# Altium schematic sheet si4463.SchDoc
size A; SheetNumber: 4; SheetTotal: 7
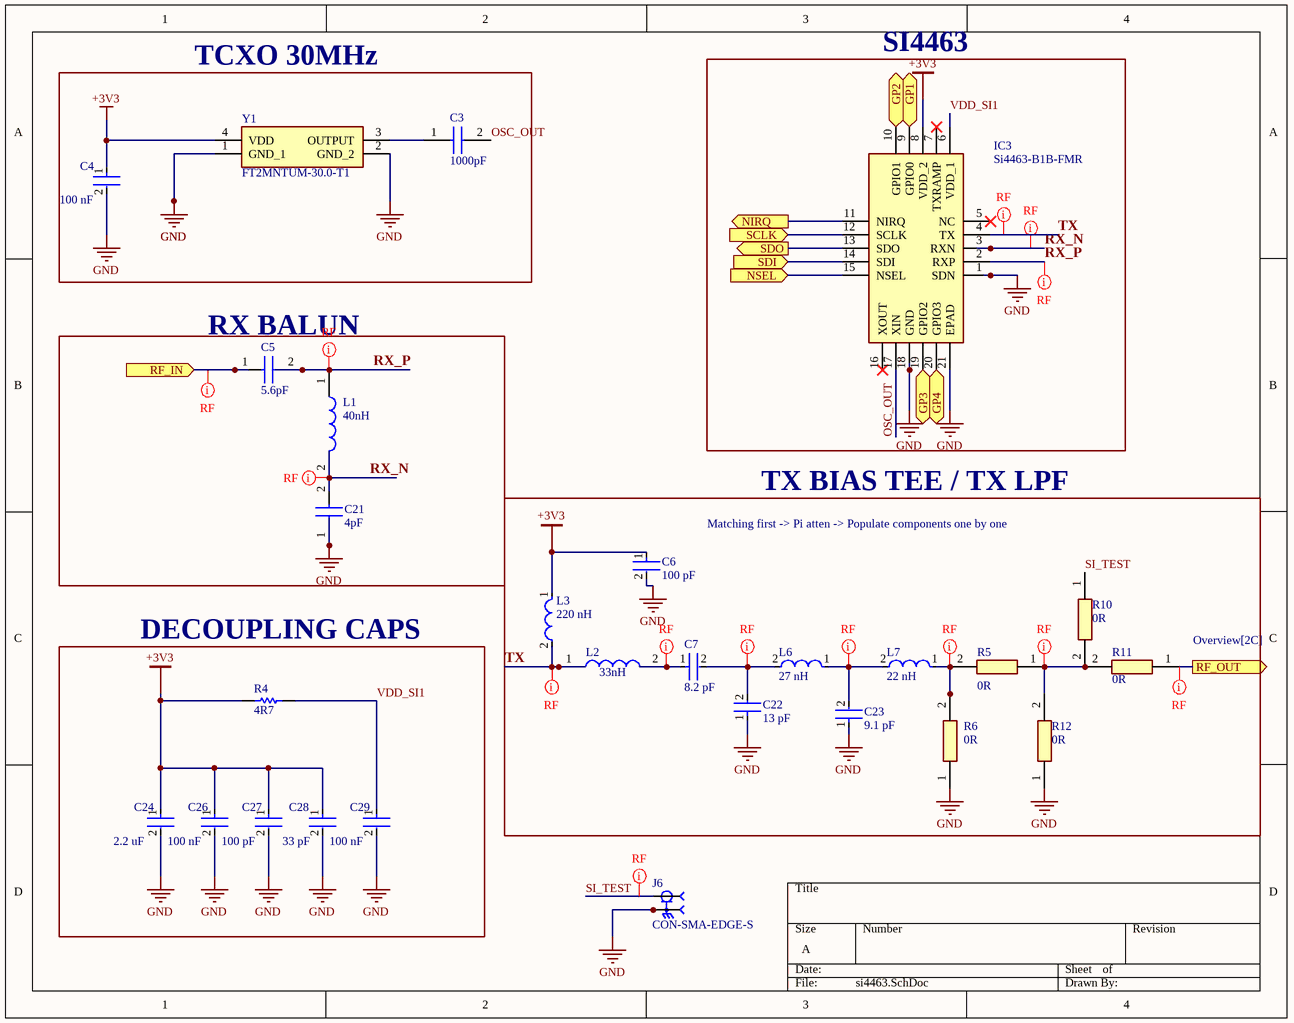
[diagram p0: si4463.SchDoc]

## Parts
C3  1000pF  [C0402]
C4  100 nF  [FP-GCM155-0_05-IPC_C]
C5  5.6pF  [CAPC1005X55N]
C6  100 pF  [FP-GQM187-0_15-MFG]
C7  8.2 pF  [FP-GJM155-0_05-MFG]
C21  4pF  [CAPC1005X55N]
C22  13 pF  [FP-GJM155-0_05-IPC_B]
C23  9.1 pF  [FP-GJM155-0_05-IPC_B]
C24  2.2 uF  [FP-GRM155-0_2-IPC_A]
C26  100 nF  [FP-GCM155-0_05-IPC_C]
C27  100 pF  [FP-GQM187-0_15-MFG]
C28  33 pF  [FP-GJM155-0_05-MFG]
C29  100 nF  [FP-GCM155-0_05-IPC_C]
IC3  Si4463-B1B-FMR  [QFN50P400X400X90-21N-D]
J6  CON-SMA-EDGE-S  [RFSOLUTIONS_CON-SMA-EDGE-S]
L1  40nH  [LQW15CNR20J00B]
L2  33nH  [LQW15CNR20J00B]
L3  220 nH  [FP-LQW18AN_80-MFG]
L6  27 nH  [FP-LQW15AN_00-W0_5-0_1-MFG]
L7  22 nH  [FP-LQW15AN_00-W0_6-0_1-MFG]
R4  4R7  [RESC3216X65X100LL20T15]
R5  0R  [RESC1608X55N]
R6  0R  [RESC1608X55N]
R10  0R  [RESC1005X40N]
R11  0R  [RESC1608X55N]
R12  0R  [RESC1608X55N]
Y1  FT2MNTUM-30.0-T1  [FT2MNTUM300T1]

## Blocks framed on the sheet
TCXO 30MHz: C3 C4 Y1
SI4463: IC3
RX BALUN: C5 C21 L1
TX BIAS TEE / TX LPF: C6 C7 C22 C23 L2 L3 L6 L7 R5 R6 R10-R12
DECOUPLING CAPS: C24 C26-C29 R4

## Ports
GP1 (bidir, see Overview[2B], MCU[2C]), GP2 (bidir, see Overview[2B], MCU[2C]), GP3 (bidir, see Overview[2B], MCU[2C]), GP4 (bidir, see Overview[2B], MCU[3C]), NIRQ (out, see Overview[2B], MCU[1B]), NSEL (in, see Overview[2B], MCU[2B]), RF_IN (in, see Overview[2B]), RF_OUT (out, see Overview[2C]), SCLK (in, see Overview[2B], MCU[1B]), SDI (in, see Overview[2B], MCU[1B]), SDO (out, see Overview[2B], MCU[1B])

## Nets
+3V3: C4.1 C6.1 C24.1 C26.1 C27.1 C28.1 IC3.8(VDD_2) L3.1 R4.1 Y1.4(VDD)
GND: C4.2 C6.2 C21.1 C22.1 C23.1 C24.2 C26.2 C27.2 C28.2 C29.2 IC3.1(SDN) IC3.18(GND) IC3.21(EPAD) J6.G1 J6.G2 J6.G3 J6.G4 R6.1 R12.1 Y1.1(GND_1) Y1.2(GND_2)
GP1: IC3.9(GPIO0) ; port GP1
GP2: IC3.10(GPIO1) ; port GP2
GP3: IC3.19(GPIO2) ; port GP3
GP4: IC3.20(GPIO3) ; port GP4
NIRQ: IC3.11(NIRQ) ; port NIRQ
NSEL: IC3.15(NSEL) ; port NSEL
OSC_OUT: C3.2 IC3.17(XIN)
RF_IN: C5.1 ; port RF_IN
RF_OUT: R11.1 ; port RF_OUT
RX_N: C21.2 IC3.3(RXN) L1.2
RX_P: C5.2 IC3.2(RXP) L1.1
SCLK: IC3.12(SCLK) ; port SCLK
SDI: IC3.14(SDI) ; port SDI
SDO: IC3.13(SDO) ; port SDO
SI_TEST: J6.1 R10.1
TX: IC3.4(TX) L2.1 L3.2
VDD_SI1: C29.1 IC3.6(VDD_1) R4.2
NetC3_1: C3.1 Y1.3(OUTPUT)
NetC7_1: C7.1 L2.2
NetC7_2: C7.2 C22.2 L6.2
NetC23_2: C23.2 L6.1 L7.2
NetL7_1: L7.1 R5.2 R6.2
NetR5_1: R5.1 R10.2 R11.2 R12.2

Not connected (* = marked no-connect by the designer): IC3 5(NC)* 7(TXRAMP)* 16(XOUT)*

## Layout directives
rule Impedance Constraint [Min = 50.00    Max = 50.00    ]; net class RF: NetC7_1, NetC7_2, NetC23_2, NetL7_1, NetR5_1, RF_IN, RF_OUT, RX_N, RX_P, SI_TEST, TX

## Notes on the sheet
- Matching first -> Pi atten -> Populate components one by one

## Library data of the parts
C3 = C0402C102K5RAC-TU: Manufacturer_Name: Yageo Group; Datasheet Link: https://www.kemet.com/specsheet/C0402C102K5RACTU; Height: 0.55mm; Manufacturer_Part_Number: C0402C102K5RAC-TU
C4 C26 C29 = CMP-2008-03711-3: Ceramic Capacitor for Automotive 100nF ±10% 16VDC X7R 0402 Paper T/R Name: GCM155R71C104KA55D; Voltage Rating (DC): 16V; Termination: SMD/SMT; Length: 1mm; Voltage: 16V; Mount: Surface Mount; Packaging: Tape and Reel; Case Code (Metric): 1005; Case/Package: 0402; Voltage Rating: 16V; Min Operating Temperature: -55°C; Case Code (Imperial): 0402; Ratings: AEC-Q200; Height: 0.5mm; Tolerance: 10%; Width: 0.02inch; Radiation Hardening: No; Depth: 0.5mm; Capacitance: 100nF; Max Operating Temperature: 125°C; Package Quantity: 1; REACH SVHC: No SVHC; Thickness: 0.022inch; Dielectric: X7R; Lead Free: Lead Free
C5 = GJM1555C1H5R6BB01D: Manufacturer_Name: Murata Electronics; Datasheet Link: https://search.murata.co.jp/Ceramy/image/img/A01X/G101/ENG/GJM1555C1H5R6BB01-01A.pdf; Height: 0.55mm; Manufacturer_Part_Number: GJM1555C1H5R6BB01D; Mouser Part Number: 81-GJM1555C1H5R6BB1D; Mouser Price/Stock: https://www.mouser.co.uk/ProductDetail/Murata-Electronics/GJM1555C1H5R6BB01D?qs=Er06SXQpt%252B61VPMQL%252BpEbg%3D%3D; Arrow Part Number: GJM1555C1H5R6BB01D; Arrow Price/Stock: https://www.arrow.com/en/products/gjm1555c1h5r6bb01d/murata-manufacturing?region=nac
C6 C27 = CMP-06035-018516-1: Ceramic Capacitor 100pF ±5% 250VDC C0G 0603 Paper T/R Name: GQM1875C2E101JB12D; Voltage Rating (DC): 250V; Min Operating Temperature: -55°C; Case Code (Metric): 1608; Lead Free: Lead Free; Length: 1.6mm; Voltage Rating: 250V; Termination: SMD/SMT; Packaging: Tape and Reel; Width: 0.031inch; Tolerance: 5%; Thickness: 0.031inch; Capacitance: 100pF; Package Quantity: 4000; Case/Package: 0603; Mount: Surface Mount; Max Operating Temperature: 125°C; Dielectric: C0G; Depth: 0.8mm; Case Code (Imperial): 0603
C7 = CMP-2008-03887-2: Multi-Layer Ceramic Capacitor 8.2pF C0G  ±0.05pF 0402 Paper T/R; Voltage Rating (DC): 50V; Termination: SMD/SMT; Packaging: Tape and Reel; Case Code (Imperial): 0402; Min Operating Temperature: -55°C; Mount: Surface Mount; Case Code (Metric): 1005; Height: 0.5mm; Length: 1mm; Dielectric: C0G; Max Operating Temperature: 125°C; Voltage Rating: 50V; Case/Package: 0402; Package Quantity: 10000; Depth: 0.5mm; Radiation Hardening: No; Width: 0.02inch; Capacitance: 8.2pF; Thickness: 0.022inch
C21 = GJM1555C1H4R0BB01D: Manufacturer_Name: Murata Electronics; Datasheet Link: https://search.murata.co.jp/Ceramy/image/img/A01X/G101/ENG/GJM1555C1H4R0BB01-01A.pdf; Height: 0.55mm; Manufacturer_Part_Number: GJM1555C1H4R0BB01D; Mouser Part Number: 81-GJM1555C1H4R0BB01; Mouser Price/Stock: https://www.mouser.com/Search/Refine.aspx?Keyword=81-GJM1555C1H4R0BB01
C22 = CMP-2008-03801-2: Multi-Layer Ceramic Capacitor 13pF C0G  ±2% 0402 Paper T/R Name: GJM1555C1H130GB01D; Voltage Rating (DC): 50V; Depth: 0.5mm; Min Operating Temperature: -55°C; Max Operating Temperature: 125°C; Packaging: Tape and Reel; Tolerance: 2%; Width: 0.5mm; Case/Package: 0402; Package Quantity: 1; Height: 0.5mm; Case Code (Metric): 1005; Radiation Hardening: No; Length: 1mm; Thickness: 0.022inch; Dielectric: C0G; Case Code (Imperial): 0402; Mount: Surface Mount; Capacitance: 13pF; Termination: SMD/SMT; Voltage Rating: 50V
C23 = CMP-2008-03892-2: Multi-Layer Ceramic Capacitor 9.1pF C0G  ±0.1pF 0402 Paper T/R Name: GJM1555C1H9R1BB01D; Voltage Rating (DC): 50V; Package Quantity: 10000; Termination: SMD/SMT; Min Operating Temperature: -55°C; Capacitance: 9.1pF; Mount: Surface Mount; Length: 1mm; Height: 0.5mm; Lead Free: Lead Free; Depth: 0.5mm; Thickness: 0.022inch; Case Code (Imperial): 0402; Radiation Hardening: No; Packaging: Tape and Reel; Case/Package: 0402; Max Operating Temperature: 125°C; Case Code (Metric): 1005; Width: 0.02inch; Dielectric: C0G; Voltage Rating: 50V
C24 = CMP-06035-014902-1: Chip Multilayer Ceramic Capacitors for General Purpose, 0402, 2.2uF, X7S, 22%, 10%, 6.3V Name: GRM155C70J225KE11D; Dielectric: X7S; Case Code (Metric): 1005; Case/Package: 0402; Voltage Rating (DC): 6.3V; Length: 0.039inch; Max Operating Temperature: 125°C; Tolerance: 10%; Width: 0.02inch; Mount: Surface Mount; Packaging: Tape and Reel; Package Quantity: 10000; Voltage Rating: 6.3V; Resistor Type: Ceramic; Min Operating Temperature: -55°C; Case Code (Imperial): 0402; Termination: SMD/SMT; Weight: 0.000212oz; Height: 0.5mm; Thickness: 0.022inch; Capacitance: 2.2uF
C28 = CMP-06035-057988-1: Multi-Layer Ceramic Capacitor 33pF C0G  ±5% 0402 Paper T/R Name: GJM1555C1H330JB01D; Voltage Rating (DC): 50V; Width: 500um; Capacitance: 33pF; Dielectric: C0G; Length: 1mm; Thickness: 500um; Tolerance: 5%
IC3 = Si4463-B1B-FMR: Integrated Circuit; Manufacturer_Name: Silicon Labs; Datasheet Link: https://www.silabs.com/documents/public/data-sheets/Si4464-63-61-60.pdf; Height: 0.9mm; Manufacturer_Part_Number: Si4463-B1B-FMR; Mouser Part Number: 634-SI4463-B1B-FMR; Mouser Price/Stock: https://www.mouser.co.uk/ProductDetail/Silicon-Labs/SI4463-B1B-FMR?qs=p9T7GgSe1IEZK64CVhf5Sg%3D%3D; Arrow Part Number: SI4463-B1B-FMR; Arrow Price/Stock: https://www.arrow.com/en/products/si4463-b1b-fmr/silicon-labs?utm_currency=USD&region=nac
J6 = CMP-002-00088-1: SMA Connector Jack, Female Socket - Board Edge, End Launch Solder; MF: RF Solutions; Source: CON-SMA-EDGE-S.SchLib; Check_prices: https://www.snapeda.com/parts/CON-SMA-EDGE-S/RF+Solutions/view-part/?ref=eda; Component Type: Standard; Purchase-URL: https://pricing.snapeda.com/search/part/CON-SMA-EDGE-S/?ref=eda; MP: CON-SMA-EDGE-S; SnapEDA_Link: https://www.snapeda.com/parts/CON-SMA-EDGE-S/RF+Solutions/view-part/?ref=snap; Pins: 5; Case/Package: None; Value: *; Digi-Key_Part_Number: CON-SMA-EDGE-S-ND; Design Item ID: CON-SMA-EDGE-S
L1 = LQW15AN40NJ00D: Manufacturer_Name: Murata Electronics; Datasheet Link: https://search.murata.co.jp/Ceramy/image/img/P02/JELF243A-0050.pdf; Height: 0.6mm; Manufacturer_Part_Number: LQW15AN40NJ00D; Mouser Part Number: 81-LQW15AN40NJ00D; Mouser Price/Stock: https://www.mouser.com/Search/Refine.aspx?Keyword=81-LQW15AN40NJ00D; Arrow Part Number: LQW15AN40NJ00D; Arrow Price/Stock: https://www.arrow.com/en/products/lqw15an40nj00d/murata-manufacturing
L2 = LQW15AN33NJ00D: Manufacturer_Name: Murata Electronics; Datasheet Link: https://search.murata.co.jp/Ceramy/image/img/P02/JELF243A-0050.pdf; Height: 0.6mm; Manufacturer_Part_Number: LQW15AN33NJ00D; Mouser Part Number: 81-LQW15AN33NJ00D; Mouser Price/Stock: https://www.mouser.co.uk/ProductDetail/Murata-Electronics/LQW15AN33NJ00D?qs=ET5ky%252B0fbz2%252Bim80KCEoEg%3D%3D; Arrow Part Number: LQW15AN33NJ00D; Arrow Price/Stock: https://www.arrow.com/en/products/lqw15an33nj00d/murata-manufacturing?region=nac
L3 = CMP-06042-006715-1: Wire Wound RF Inductor for Automotive 220nH ±5% 280mA 2.08Ω 0603 (1608) Name: LQW18ANR22J8ZD
L6 = CMP-06042-004466-1: Wire Wound RF Inductor 27nH ±3% 280mA 0.52Ω 0402 (1005) Name: LQW15AN27NH00D; Test Frequency: 100MHz; Shielding: Unshielded; Current: 260mA; Self Resonant Frequency: 3.5GHz; DC Resistance (DCR): 520mR; Q Factor: 25; Core Material: Non-Magnetic; Current Rating: 280mA; Max Operating Temperature: 125°C; Width: 0.02inch; Tolerance: 3%; Mount: Surface Mount; Case Code (Imperial): 0402; Weight: 2.8E-05oz; Depth: 0.6mm; Packaging: Tape and Reel; Height - Seated (Max): 0.024inch; DC Current: 280mA; Length: 1mm; Inductance: 27nH; Max DC Current: 280mA; Resistor Type: Wirewound; Min Operating Temperature: -55°C; Lead Free: Lead Free; Package Quantity: 10000; Height: 0.5mm; Termination: SMD/SMT; Case/Package: 0402; Military Standard: Not; Case Code (Metric): 1005
L7 = CMP-06042-001125-1: Wire Wound RF Inductor 22nH ±3% 310mA 0.3Ω 0402 (1005) Name: LQW15AN22NH00D; Self Resonant Frequency: 4GHz; Q Factor: 25; Current: 750mA; Shielding: Unshielded; DC Resistance (DCR): 300mR; Test Frequency: 100MHz; Core Material: Non-Magnetic; Lead Free: Lead Free; Height - Seated (Max): 0.024inch; Max Operating Temperature: 125°C; Current Rating: 310mA; Min Operating Temperature: -55°C; Inductance: 22nH; Resistor Type: Wirewound; Case Code (Imperial): 0402; Weight: 2.8E-05oz; Case/Package: 0402; DC Current: 310mA; Height: 0.5mm; Width: 0.5mm; Max DC Current: 310mA; Radiation Hardening: No; Case Code (Metric): 1005; Length: 1mm; Military Standard: Not; Mount: Surface Mount; Termination: SMD/SMT; Tolerance: 3%; Packaging: Tape and Reel; Depth: 0.7mm; Package Quantity: 10000
R4 = CMP-2003-04707-1: Name: RL1632R-4R70-F; Manufacturer: Susumu; Part Number: RL1632R-4R70-F
R5 R6 R11 R12 = RC0603JR-070RL: Manufacturer_Name: Yageo Group; Datasheet Link: http://www.yageo.com/documents/recent/PYu-RC0603_51_RoHS_L_v5.pdf; Height: 0.55mm; Manufacturer_Part_Number: RC0603JR-070RL; Mouser Part Number: 603-RC0603JR-070RL; Mouser Price/Stock: https://www.mouser.co.uk/ProductDetail/YAGEO/RC0603JR-070RL?qs=2cAdsCoAWRGWyPcuXgGiXQ%3D%3D; Arrow Part Number: RC0603JR-070RL; Arrow Price/Stock: https://www.arrow.com/en/products/rc0603jr-070rl/yageo?utm_currency=USD&region=nac
R10 = RC0402JR-070RL: Manufacturer_Name: Yageo Group; Datasheet Link: https://www.yageo.com/upload/media/product/products/datasheet/rchip/PYu-RC_Group_51_RoHS_L_12.pdf; Height: 0.4mm; Manufacturer_Part_Number: RC0402JR-070RL; Mouser Part Number: 603-RC0402JR-070RL; Mouser Price/Stock: https://www.mouser.co.uk/ProductDetail/YAGEO/RC0402JR-070RL?qs=5Bml4Cp94iv7ykKkzPrwpQ%3D%3D; Arrow Part Number: RC0402JR-070RL; Arrow Price/Stock: https://www.arrow.com/en/products/rc0402jr-070rl/yageo.html?utm_currency=USD&region=europe
Y1 = FT2MNTUM-30.0-T1: Crystal or Oscillator; Manufacturer_Name: ABRACON; Datasheet Link: https://abracon.com/datasheets/FT2MN.pdf; Height: 1mm; Manufacturer_Part_Number: FT2MNTUM-30.0-T1; Mouser Part Number: 815-FT2MNTUM-30.0-T1; Mouser Price/Stock: https://www.mouser.co.uk/ProductDetail/ABRACON/FT2MNTUM-30.0-T1?qs=9vOqFld9vZU1LRBjatCK%2Fw%3D%3D; Arrow Part Number: FT2MNTUM-30.0-T1; Arrow Price/Stock: https://www.arrow.com/en/products/ft2mntum-30.0-t1/abracon?region=nac